# EAGLE design RTD COMPARATOR BOARD (EAGLE 6.4)
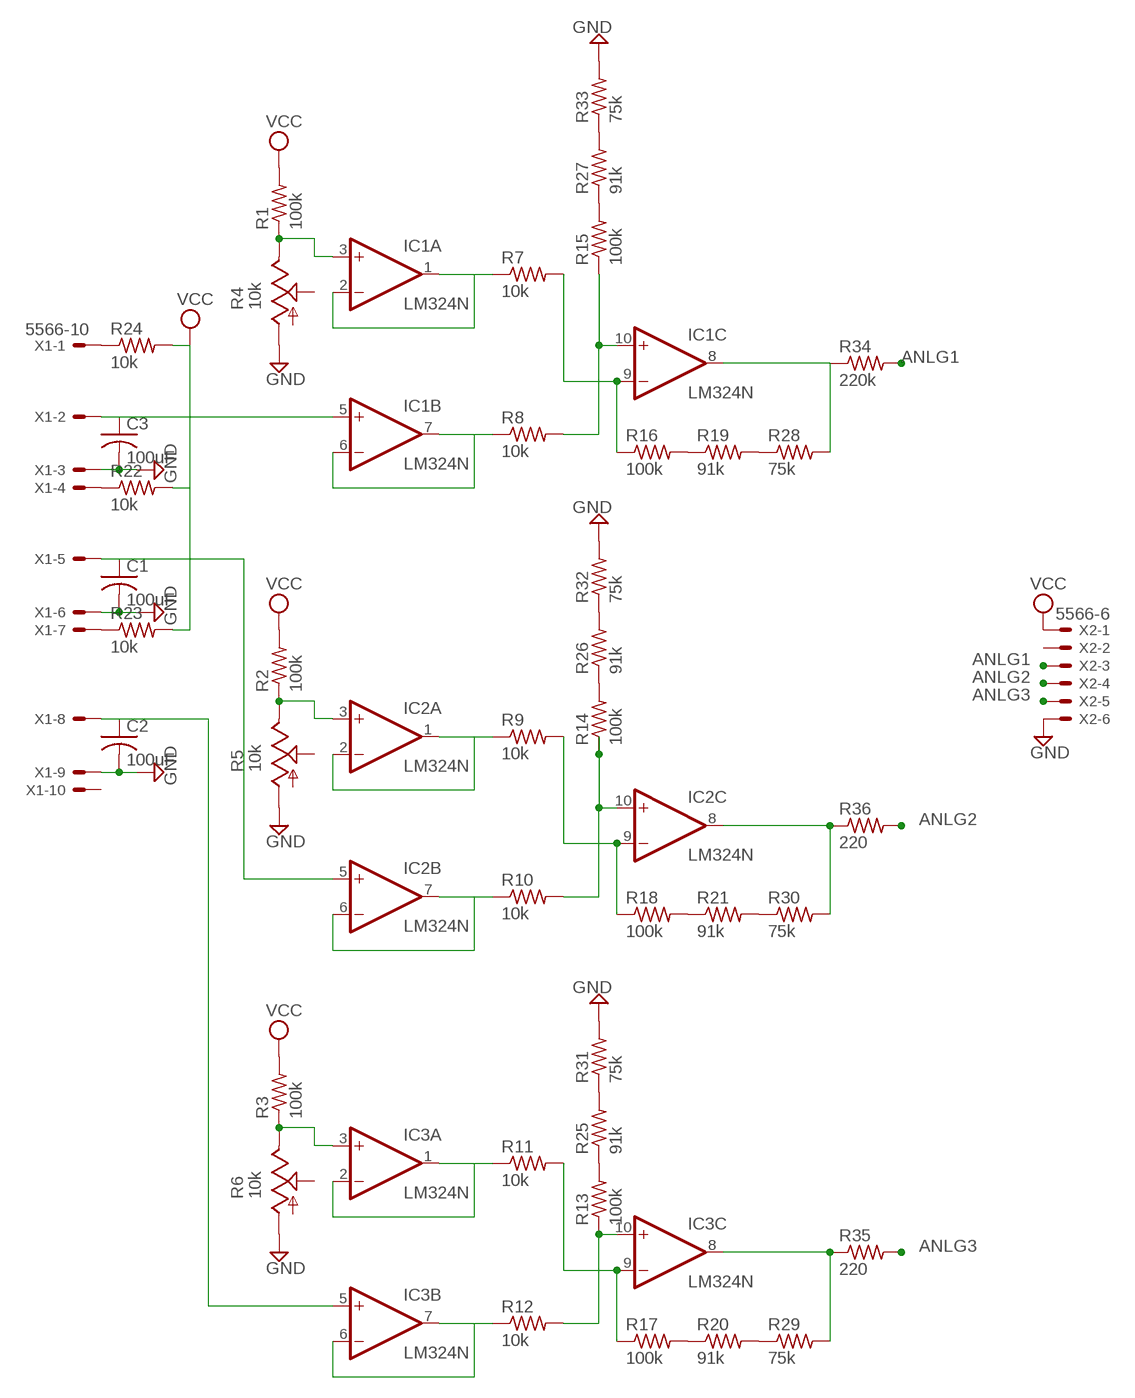
[diagram p0: schematic, sheet 1]

## Parts
C1  100uF  C-US025-025X050  [C025-025X050]
C2  100uF  C-US025-025X050  [C025-025X050]
C3  100uF  C-US025-025X050  [C025-025X050]
IC1  LM324N  [DIL14]
IC2  LM324N  [DIL14]
IC3  LM324N  [DIL14]
R1  100k  R-US_0204/2V  [0204V]
R2  100k  R-US_0204/2V  [0204V]
R3  100k  R-US_0204/2V  [0204V]
R4  10k  TRIM_US-B25P  [B25P]
R5  10k  TRIM_US-B25P  [B25P]
R6  10k  TRIM_US-B25P  [B25P]
R7  10k  R-US_0204/2V  [0204V]
R8  10k  R-US_0204/2V  [0204V]
R9  10k  R-US_0204/2V  [0204V]
R10  10k  R-US_0204/2V  [0204V]
R11  10k  R-US_0204/2V  [0204V]
R12  10k  R-US_0204/2V  [0204V]
R13  100k  R-US_0204/2V  [0204V]
R14  100k  R-US_0204/2V  [0204V]
R15  100k  R-US_0204/2V  [0204V]
R16  100k  R-US_0204/2V  [0204V]
R17  100k  R-US_0204/2V  [0204V]
R18  100k  R-US_0204/2V  [0204V]
R19  91k  R-US_0204/2V  [0204V]
R20  91k  R-US_0204/2V  [0204V]
R21  91k  R-US_0204/2V  [0204V]
R22  10k  R-US_0204/2V  [0204V]
R23  10k  R-US_0204/2V  [0204V]
R24  10k  R-US_0204/2V  [0204V]
R25  91k  R-US_0204/2V  [0204V]
R26  91k  R-US_0204/2V  [0204V]
R27  91k  R-US_0204/2V  [0204V]
R28  75k  R-US_0204/2V  [0204V]
R29  75k  R-US_0204/2V  [0204V]
R30  75k  R-US_0204/2V  [0204V]
R31  75k  R-US_0204/2V  [0204V]
R32  75k  R-US_0204/2V  [0204V]
R33  75k  R-US_0204/2V  [0204V]
R34  220k  R-US_0204/2V  [0204V]
R35  220  R-US_0204/2V  [0204V]
R36  220  R-US_0204/2V  [0204V]
X1  5566-10  [5566-10]
X2  5566-6  [5566-6]

## Nets
ANLG1: R34.2 X2.3
ANLG2: R36.2 X2.4
ANLG3: R35.2 X2.5
GND: C1.2 C2.2 C3.2 R4.A R5.A R6.A R31.2 R32.2 R33.2 X1.3 X1.6 X1.9 X2.6
N$1: R21.2 R30.1
N$2: R18.2 R21.1
N$3: R24.1 X1.1
N$4: R22.1 X1.4
N$5: R20.2 R29.1
N$6: R17.2 R20.1
N$7: R14.2 R26.1
N$8: R26.2 R32.1
N$9: IC2.5(B:+IN)
N$10: IC2.3(A:+IN) R2.1 R5.E
N$11: R23.1 X1.7
N$12: R13.2 R25.1
N$13: IC1.3(A:+IN) R1.1 R4.E
N$14: C1.1 X1.5
N$15: IC2.1(A:OUT) IC2.2(A:-IN) R9.1
N$16: IC2.9(C:-IN) R9.2 R18.1
N$17: R25.2 R31.1
N$18: IC1.9(C:-IN) R7.2 R16.1
N$19: IC1.1(A:OUT) IC1.2(A:-IN) R7.1
N$20: IC2.6(B:-IN) IC2.7(B:OUT) R10.1
N$21: IC1.6(B:-IN) IC1.7(B:OUT) R8.1
N$22: IC1.10(C:+IN) R8.2 R15.1
N$23: IC1.8(C:OUT) R28.2 R34.1
N$24: C3.1 IC1.5(B:+IN) X1.2
N$25: X1.8
N$26: IC2.10(C:+IN) R10.2 R14.1
N$27: R19.2 R28.1
N$28: R16.2 R19.1
N$29: IC2.8(C:OUT) R30.2 R36.1
N$30: R15.2 R27.1
N$31: R27.2 R33.1
N$32: IC3.5(B:+IN)
N$33: IC3.3(A:+IN) R3.1 R6.E
N$34: IC3.1(A:OUT) IC3.2(A:-IN) R11.1
N$35: IC3.9(C:-IN) R11.2 R17.1
N$36: IC3.6(B:-IN) IC3.7(B:OUT) R12.1
N$37: IC3.10(C:+IN) R12.2 R13.1
N$38: IC3.8(C:OUT) R29.2 R35.1
VCC: R1.2 R2.2 R3.2 R22.2 R23.2 R24.2 X2.1
Unconnected: C2.1 IC1.12(D:+IN) IC1.13(D:-IN) IC1.14(D:OUT) IC2.12(D:+IN) IC2.13(D:-IN) IC2.14(D:OUT) IC3.12(D:+IN) IC3.13(D:-IN) IC3.14(D:OUT) R4.S R5.S R6.S X1.10 X2.2

## Power pins joined to a net without a drawn wire
V+: IC1.4(P:V+) IC2.4(P:V+) IC3.4(P:V+)
V-: IC1.11(P:V-) IC2.11(P:V-) IC3.11(P:V-)

## Library data of the parts
C1-C3 = adafruit:C-US: CAPACITOR, American symbol
IC1-IC3 = linear:LM324: OP AMP
R1-R3 R7-R36 = adafruit:R-US_: RESISTOR, American symbol
R4-R6 = pot:TRIM_US-: POTENTIOMETER
X1 = con-molex:5566-10: Mini FIT connector 10 pol Source: http://www.molex.com; OC_FARNELL: unknown; OC_NEWARK: unknown
X2 = con-molex:5566-6: Mini FIT connector 6 pol Source: http://www.molex.com; MPN: 95566-61002; OC_FARNELL: unknown; OC_NEWARK: 22K8620

## Net classes
0 default: width 0.381 mm, drill 0.001 mm, clearance 0.254 mm

## Board
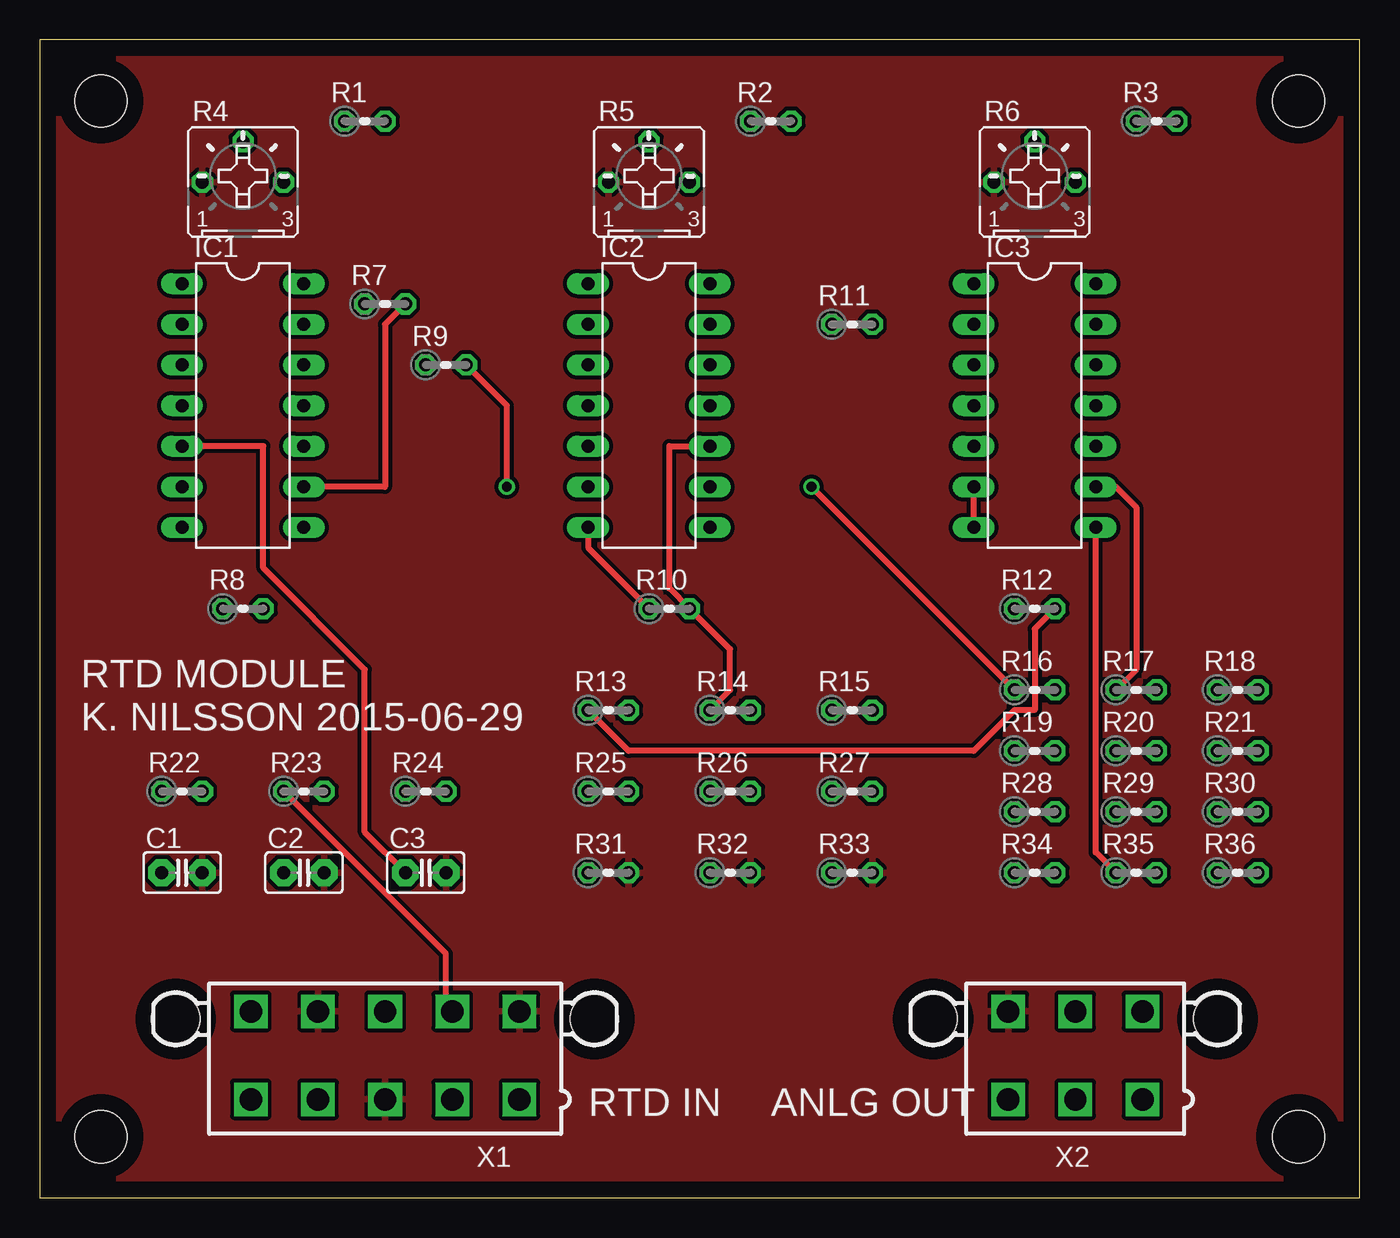
[diagram p1: board, top side]
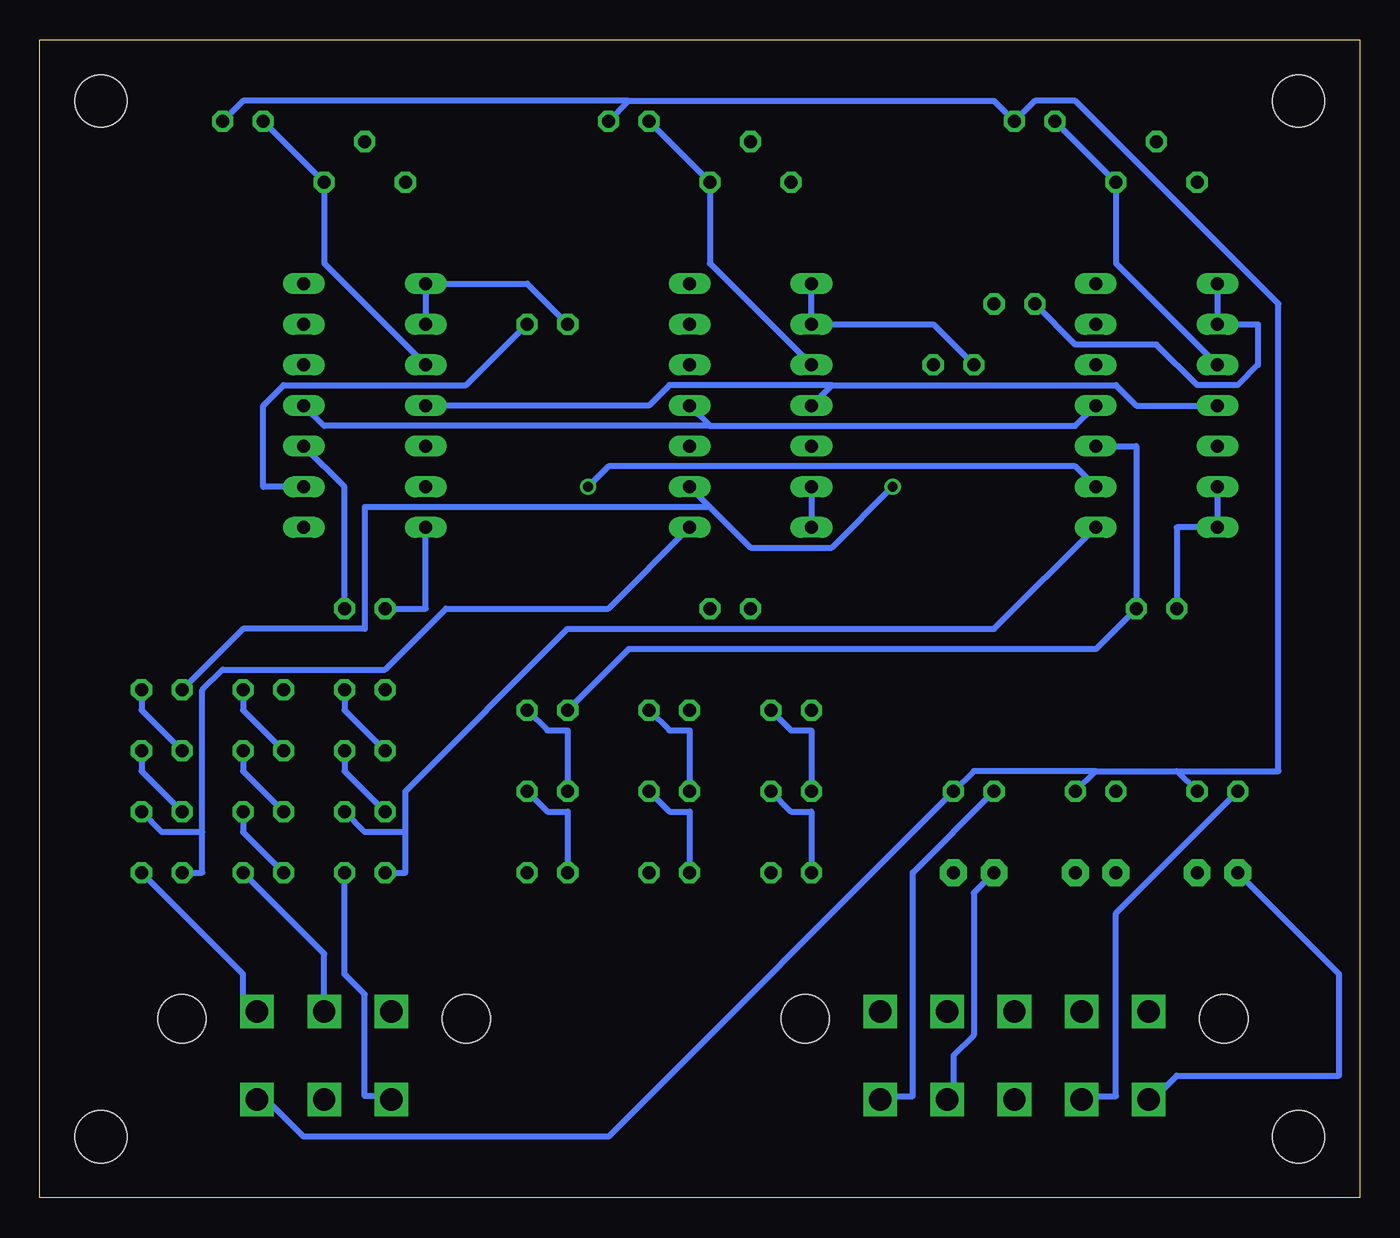
[diagram p2: board, bottom side, seen from below]

Size 82.55 x 72.39 mm. Coordinates in mm from the lower left corner, seen from the top.
Outline: 0,0 82.55,0 82.55,72.39 0,72.39 0,0
Copper layers (1*16): Top 0.035mm / dielectric 1.5mm / Bottom 0.035mm
Design rules "default": minimum track width 10mil, minimum drill 24mil, track to track 8mil, track to pad 8mil, pad to pad 8mil, via to via 8mil, smd to smd 8mil, copper to edge 40mil, drill to drill 8mil, minimum pad ring 10mil, minimum via ring 8mil, stop-mask expansion 4mil, vias tented up to drill 0mil, thermal gap 10mil
Holes 3.26 mm at 3.81,3.81 78.74,3.81 78.74,68.58 3.81,68.58

### Footprints (pad centres in the part's own frame; a part is rotated, then mirrored left to right if it is on the bottom)
C025-025X050 = drill 0.813 pad 1.676 octagon: 1 -1.27,0; 2 1.27,0
DIL14 = drill 0.813 long: 1 -7.62,-3.81; 2 -5.08,-3.81; 3 -2.54,-3.81; 4 0,-3.81; 5 2.54,-3.81; 6 5.08,-3.81; 7 7.62,-3.81; 8 7.62,3.81; 9 5.08,3.81; 10 2.54,3.81; 11 0,3.81; 12 -2.54,3.81; 13 -5.08,3.81; 14 -7.62,3.81
0204V = drill 0.813 octagon: 1 -1.27,0; 2 1.27,0
B25P = drill 0.813 octagon: A -2.54,0; E 2.54,0; S 0,2.54
5566-10 = drill 1.4 square: 1 8.4,-2.75; 2 4.2,-2.75; 3 0,-2.75; 4 -4.2,-2.75; 5 -8.4,-2.75; 6 8.4,2.75; 7 4.2,2.75; 8 0,2.75; 9 -4.2,2.75; 10 -8.4,2.75 | hole 3: 13.1,2.29; -13.1,2.29
5566-6 = drill 1.4 square: 1 4.2,-2.75; 2 0,-2.75; 3 -4.2,-2.75; 4 4.2,2.75; 5 0,2.75; 6 -4.2,2.75 | hole 3: 8.9,2.29; -8.9,2.29

### Placement (x,y rotation side)
C1  8.89,20.32 0 top
C2  16.51,20.32 0 top
C3  24.13,20.32 0 top
IC1  12.7,49.53 270 top
IC2  38.1,49.53 270 top
IC3  62.23,49.53 270 top
R1  20.32,67.31 0 top
R2  45.72,67.31 0 top
R3  69.85,67.31 0 top
R4  12.7,63.5 0 top
R5  38.1,63.5 0 top
R6  62.23,63.5 0 top
R7  21.59,55.88 0 top
R8  12.7,36.83 0 top
R9  25.4,52.07 0 top
R10  39.37,36.83 0 top
R11  50.8,54.61 0 top
R12  62.23,36.83 0 top
R13  35.56,30.48 0 top
R14  43.18,30.48 0 top
R15  50.8,30.48 0 top
R16  62.23,31.75 0 top
R17  68.58,31.75 0 top
R18  74.93,31.75 0 top
R19  62.23,27.94 0 top
R20  68.58,27.94 0 top
R21  74.93,27.94 0 top
R22  8.89,25.4 0 top
R23  16.51,25.4 0 top
R24  24.13,25.4 0 top
R25  35.56,25.4 0 top
R26  43.18,25.4 0 top
R27  50.8,25.4 0 top
R28  62.23,24.13 0 top
R29  68.58,24.13 0 top
R30  74.93,24.13 0 top
R31  35.56,20.32 0 top
R32  43.18,20.32 0 top
R33  50.8,20.32 0 top
R34  62.23,20.32 0 top
R35  68.58,20.32 0 top
R36  74.93,20.32 0 top
X1  21.59,8.89 0 top
X2  64.77,8.89 0 top

### Tracks (layer width: path | path; a pad name or v marks a point on that pad's centre or on a via)
ANLG1
  Bottom 0.381: R34.2 63.5,13.97 62.23,12.7 62.23,6.35 60.96,6.35 X2.3
ANLG2
  Bottom 0.381: R36.2 69.85,13.97 69.85,11.43 X2.4
ANLG3
  Bottom 0.381: R35.2 64.77,15.24 X2.5 64.77,11.43
GND
  pour Top: -2.54,81.28 -2.54,-1.27 101.6,-1.27 101.6,1.27 101.6,81.28
N$1
  Bottom 0.381: R30.1 76.2,26.67 R21.2
N$2
  Bottom 0.381: R21.1 76.2,30.48 R18.2
N$3
  Bottom 0.381: R24.1 27.94,20.32 27.94,6.35 29.21,6.35 X1.1
N$4
  Bottom 0.381: R22.1 15.24,17.78 15.24,6.35 16.51,6.35 X1.4
N$5
  Bottom 0.381: R29.1 69.85,26.67 R20.2
N$6
  Bottom 0.381: R20.1 69.85,30.48 R17.2
N$7
  Bottom 0.381: R26.1 41.91,29.21 43.18,29.21 R14.2
N$8
  Bottom 0.381: R32.1 41.91,24.13 43.18,24.13 R26.2
N$10
  Bottom 0.381: IC2.3 40.64,58.42 R5.E R2.1
N$11
  Top 0.381: R23.1 25.4,15.24 25.4,11.43 X1.7
N$12
  Bottom 0.381: R25.1 34.29,29.21 35.56,29.21 R13.2
N$13
  Bottom 0.381: IC1.3 15.24,58.42 R4.E R1.1
N$14
  Bottom 0.381: C1.1 1.27,13.97 1.27,7.62 11.43,7.62 12.7,6.35 X1.5
N$15
  Bottom 0.381: R9.1 26.67,54.61 IC2.2 IC2.1
N$16  (via drill 0.61)
  Top 0.381: R9.2 29.21,49.53 v29.21,44.45
  Bottom 0.381: v29.21,44.45 33.02,40.64 38.1,40.64 40.64,43.18 | IC2.9 40.64,43.18 | R18.1 69.85,35.56 62.23,35.56 62.23,43.18 40.64,43.18
N$17
  Bottom 0.381: R31.1 34.29,24.13 35.56,24.13 R25.2
N$18  (via drill 0.61)
  Top 0.381: IC1.9 21.59,44.45 21.59,54.61 R7.2 | v48.26,44.45 R16.1
  Bottom 0.381: v48.26,44.45 46.99,45.72 17.78,45.72 IC1.9
N$19
  Bottom 0.381: IC1.1 IC1.2 6.35,54.61 6.35,52.07 7.62,50.8 10.16,50.8 12.7,53.34 17.78,53.34 R7.1
N$20
  Top 0.381: R10.1 34.29,40.64 IC2.7
  Bottom 0.381: IC2.6 IC2.7
N$21
  Bottom 0.381: IC1.6 IC1.7 11.43,41.91 R8.1
N$22
  Bottom 0.381: IC1.10 13.97,46.99 R8.2 16.51,34.29 45.72,34.29 R15.1
N$23
  Bottom 0.381: IC1.8 22.86,35.56 49.53,35.56 59.69,25.4 59.69,22.86 | 59.69,22.86 59.69,20.32 R34.1 | R28.2 62.23,22.86 59.69,22.86
N$24
  Top 0.381: IC1.5 13.97,46.99 13.97,39.37 20.32,33.02 20.32,22.86 C3.1
  Bottom 0.381: C3.1 24.13,19.05 24.13,10.16 25.4,8.89 25.4,6.35 X1.2
N$26
  Top 0.381: R14.1 43.18,31.75 43.18,34.29 R10.2 39.37,38.1 39.37,46.99 IC2.10
N$27
  Bottom 0.381: R28.1 63.5,26.67 R19.2
N$28
  Bottom 0.381: R19.1 63.5,30.48 R16.2
N$29
  Bottom 0.381: IC2.8 46.99,36.83 57.15,36.83 60.96,33.02 71.12,33.02 72.39,31.75 72.39,22.86 | 72.39,22.86 72.39,20.32 R36.1 | R30.2 74.93,22.86 72.39,22.86
N$30
  Bottom 0.381: R27.1 49.53,29.21 50.8,29.21 R15.2
N$31
  Bottom 0.381: R33.1 49.53,24.13 50.8,24.13 R27.2
N$33
  Bottom 0.381: IC3.3 64.77,58.42 R6.E R3.1
N$34
  Bottom 0.381: R11.1 52.07,57.15 IC3.1 IC3.2
N$35
  Top 0.381: R17.1 68.58,33.02 68.58,43.18 67.31,44.45 IC3.9
  Bottom 0.381: R11.2 55.88,50.8 67.31,50.8 68.58,49.53 68.58,44.45 IC3.9
N$36
  Top 0.381: IC3.7 IC3.6
  Bottom 0.381: IC3.7 58.42,36.83 R12.1
N$37
  Top 0.381: R13.1 36.83,27.94 58.42,27.94 60.96,30.48 62.23,30.48 62.23,35.56 R12.2
  Bottom 0.381: IC3.10 63.5,44.45 R12.2
N$38
  Top 0.381: IC3.8 66.04,21.59 R35.1
  Bottom 0.381: R35.1 69.85,22.86 R29.2
V+
  Bottom 0.381: IC1.4 13.97,49.53 15.24,50.8 33.02,50.8 | IC2.4 33.02,50.8 | IC3.4 44.45,49.53 43.18,50.8 33.02,50.8
V-
  Bottom 0.381: IC1.11 17.78,48.26 40.64,48.26 | IC2.11 40.64,48.26 | IC3.11 64.77,48.26 40.64,48.26
VCC
  Bottom 0.381: 45.72,68.58 22.86,68.58 R1.2 20.32,68.58 17.78,68.58 5.08,55.88 5.08,26.67 11.43,26.67 | R2.2 45.72,68.58 | R3.2 69.85,68.58 45.72,68.58 | 11.43,26.67 R22.2 | 16.51,26.67 11.43,26.67 | R23.2 16.51,26.67 | 16.51,26.67 24.13,26.67 R24.2 46.99,3.81 66.04,3.81 68.58,6.35 X2.1

### Text on the board
tSilk: RTD MODULE / K. NILSSON 2015-06-29 | RTD IN | ANLG OUT